# Altium schematic sheet 滑板车模块-20718.SchDoc
size A4
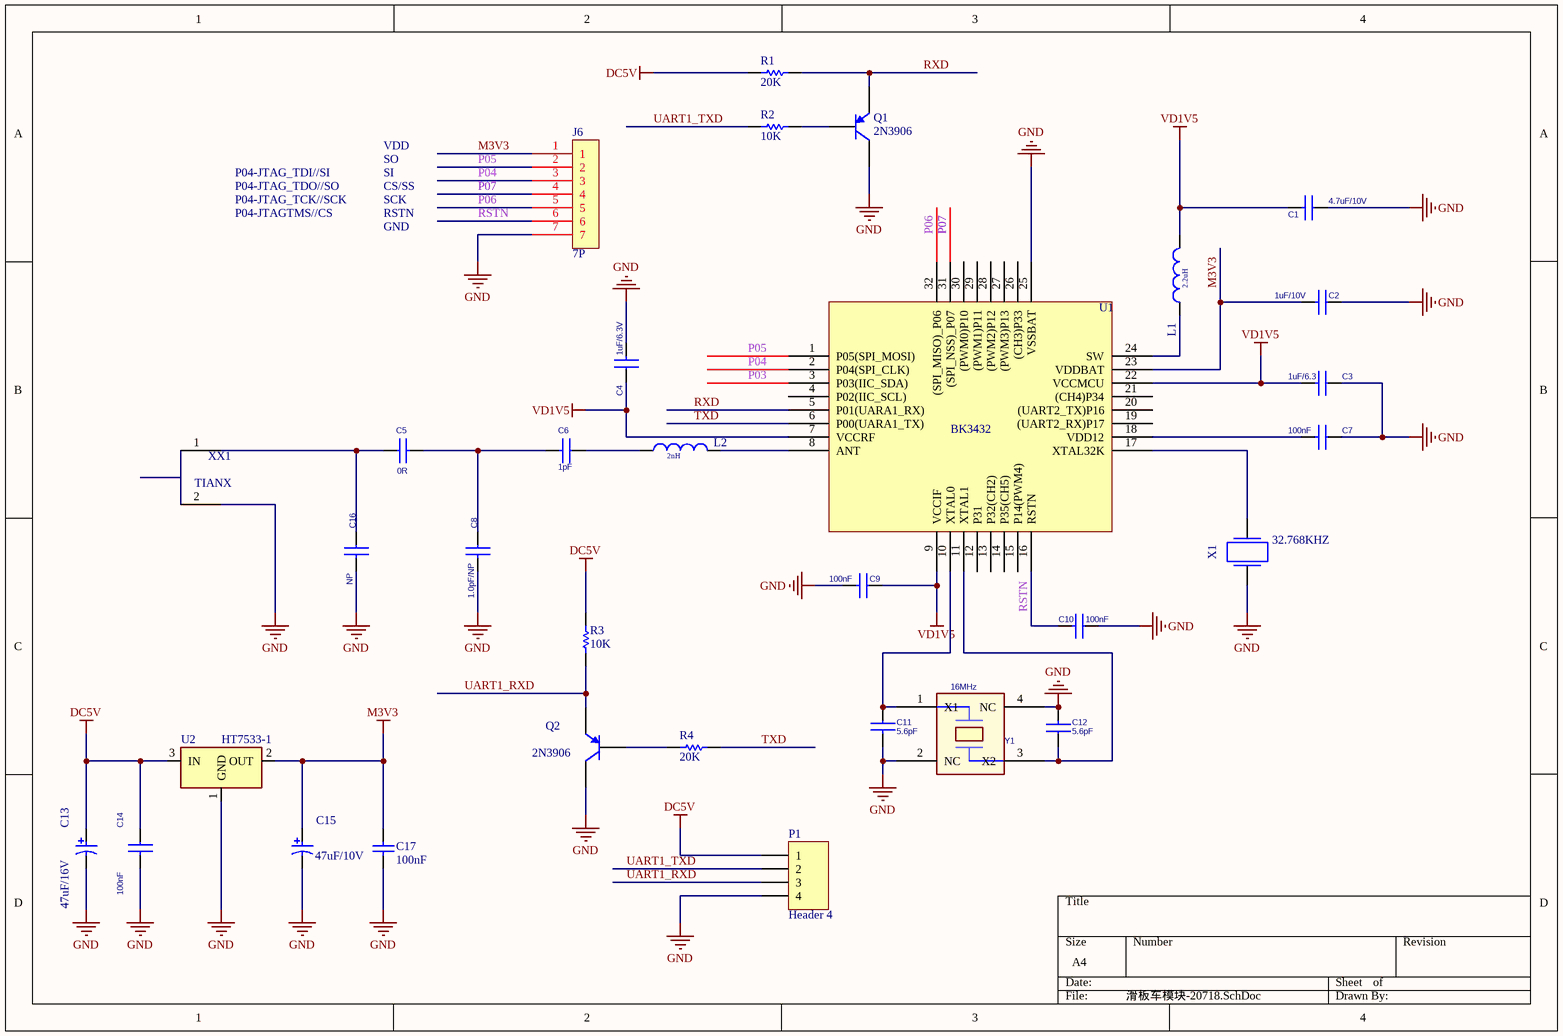
[diagram p0: 滑板车模块-20718.SchDoc]

## Parts
C1  4.7uF/10V  [LC-0402_C]
C2  1uF/10V  [LC-0402_C]
C3  1uF/6.3  [LC-0402_C]
C4  1uF/6.3V  [LC-0402_C]
C5  0R  [LC-0402_C]
C6  1pF  [LC-0402_C]
C7  100nF  [LC-0402_C]
C8  1.0pF/NP  [LC-0402_C]
C9  100nF  [LC-0402_C]
C10  100nF  [LC-0402_C]
C11  5.6pF  [LC-0402_C]
C12  5.6pF  [LC-0402_C]
C13  47uF/16V  [LC-0805_C]
C14  100nF  [LC-0603_C]
C15  47uF/10V  [LC-0805_C]
C16  NP  [LC-0402_C]
C17  100nF  [LC-0603_C]
J6  7P  [7P-2.0MM]
L1  2.2uH  [LC-0603_L]
L2  2nH  [LC-0402_L]
P1  Header 4  [S4B-PH-SM3-TB]
Q1  2N3906  [SOT-23-3]
Q2  2N3906  [SOT-23-3]
R1  20K  [0603R]
R2  10K  [0603R]
R3  10K  [0603R]
R4  20K  [0603R]
U1  BK3432  [LC-VQFN-32_4x4x04P]
U2  HT7533-1  [SOT-23-3L]
X1  32.768KHZ  [晶振-9]
XX1  TIANX  [ANT_L_TYPEA_MIRROR]
Y1  16MHz  [SMT-3225]

## Nets
DC5V: C13.1 C14.1 P1.1 R1.1 R3.1 U2.3(IN)
GND: C1.1 C2.1 C3.1 C4.2 C7.1 C8.2 C9.2 C10.1 C11.2 C12.2 C13.2 C14.2 C15.2 C16.2 C17.2 J6.7 P1.4 Q1.3(C) Q2.3(C) U1.25(VSSBAT) U2.1(GND) X1.1(A) XX1.2 Y1.2(NC) Y1.4(NC)
M3V3: C2.2 C15.1 C17.1 J6.1 U1.23(VDDBAT) U2.2(OUT)
VD1V5: C1.2 C3.2 C4.1 C9.1 L1.2(P2) U1.7(VCCRF) U1.9(VCCIF) U1.22(VCCMCU)
P03: U1.3(P03(IIC_SDA))
P04: J6.3 U1.2(P04(SPI_CLK))
P05: J6.2 U1.1(P05(SPI_MOSI))
P06: J6.5 U1.32((SPI_MISO)_P06)
P07: J6.4 U1.31((SPI_NSS)_P07)
RSTN: C10.2 J6.6 U1.16(RSTN)
RXD: Q1.2(E) R1.2 U1.5(P01(UARA1_RX))
TXD: R4.1 U1.6(P00(UARA1_TX))
UART1_RXD: P1.3 Q2.2(E) R3.2
UART1_TXD: P1.2 R2.1
NetC5_1: C5.1 C16.1 XX1.1
NetC5_2: C5.2 C6.2 C8.1
NetC6_1: C6.1 L2.1(P1)
NetC7_2: C7.2 U1.18(VDD12)
NetC11_1: C11.1 U1.10(XTAL0) Y1.1(X1)
NetC12_1: C12.1 U1.11(XTAL1) Y1.3(X2)
NetL1_1: L1.1(P1) U1.24(SW)
NetL2_2: L2.2(P2) U1.8(ANT)
NetQ1_1: Q1.1(B) R2.2
NetQ2_1: Q2.1(B) R4.2
NetU1_17: U1.17(XTAL32K) X1.2(B)

Not connected (* = marked no-connect by the designer): U1 4(P02(IIC_SCL)) 12(P31) 13(P32(CH2)) 14(P35(CH5)) 15(P14(PWM4)) 19((UART2_RX)P17) 20((UART2_TX)P16) 21((CH4)P34) 26((CH3)P33) 27((PWM3)P13) 28((PWM2)P12) 29((PWM1)P11) 30((PWM0)P10)

## Notes on the sheet
- P04-JTAG_TDI//SI
- SI
- SO
- VDD
- P04-JTAG_TDO//SO
- P04-JTAG_TCK//SCK
- P04-JTAGTMS//CS
- RSTN
- SCK
- CS/SS
- GND

## Library data of the parts
C1-C12 C16 = CAP0603
C13 C15 = CAP-P: Capacitor, tolerance ±20%
C14 = CAP NP
C17 = CAP-NP: Capacitor, Ceramic; Capacitance: 18 pF; Dielectric: COG; Polarity: Non-Polarized; Rated Voltage: 50 mV; Tolerance: 5 %; Category: Capacitor; Mounting Technology: Surface Mount; Status: Unreleased; Technology: Ceramic
L1 L2 = INDUCTOR: Power Inductor, 4.7uH, 0.7A, 260mR DCR; XMOS Part Number: E-09-0011; Manufacturer: Taiyo Yuden; Manufacturer Part Number: CBC2518T4R7M; Part Creator: JG; LEVEL: STD; DEVICE: L; FORWARD_PCB: 1; Tolerance (%): 20; Max DC Resistance: 0.26R; Rated Current (Saturation): 0.68A; Rated Current (Temp Rise): 0.92A; Approx Volume Cost ($): 0.07; Approved: NO; VALUE: 2.0nH; Datasheet: http://www.yuden.co.jp/us/product/pdf/ecb2_e.pdf; Max Height (mm): 2; Digikey Link: http://search.digikey.com/scripts/DkSearch/dksus.dll?lang=en&site=US&keywords=CBC2518T4R7M
P1 = Header 4: Header, 4-Pin; LatestRevisionDate: 17-Jul-2002; LatestRevisionNote: Re-released for DXP Platform.; Publisher: Altium Limited
Q1 Q2 = 2N3906: PNP General Purpose Amplifier; Published: 8-Jun-2000; LatestRevisionDate: 15-Jan-2003; LatestRevisionNote: PCB Footprint 'BCY-W3/D4.7' replaced; DatasheetVersion: 1997; PackageVersion: Sep-1998; PackageReference: TO-92A; Publisher: Altium Limited; PackageDescription: TO, Flat Index; 3 In-Line, Axial Leads; Body Dia. 4.5mm; Leads 0.51 x 0.48 mm (max); ComponentLink1Description: Manufacturer Link; ComponentLink1URL: http://www.fairchildsemi.com/; ComponentLink2Description: Datasheet; ComponentLink2URL: http://www.fairchildsemi.com/ds/2N%2F2N3906.pdf
R1-R4 = Res1: Resistor; Value: 1K; Published: 8-Jun-2000; LatestRevisionDate: 17-Jul-2002; LatestRevisionNote: Re-released for DXP Platform.; PackageReference: AXIAL-0.3; Publisher: Altium Limited; PackageDescription: Axial Device, Thru-Hole; 2 Leads; 0.3 in Pin Spacing
U2 = XC6206P302M
X1 = CRYSTAL: Crystal, 24MHz, HC49/US SMD, Fundamental, 18pF, Tol. ?0ppm, Stab. ?0ppm; XMOS Part Number: E-07-0030; Manufacturer: Abracon; Manufacturer Part Number: ABLS-24.000MHz-B4; Part Creator: JG; LEVEL: STD; DEVICE: X; FORWARD_PCB: 1; Approx Volume Cost ($): 0.15; Approved: NO; VALUE: ABLS; Datasheet: http://www.abracon.com/Resonators/abls.pdf; Max Height (mm): 4.2; Supplier Link: http://search.digikey.com/scripts/DkSearch/dksus.dll?lang=en&site=US&keywords=ABLS-24.000MHz-B4; FREQUENCY: 32.768KHZ
Y1 = OSCILATOR_0